# Altium project DevKit.PrjPcb
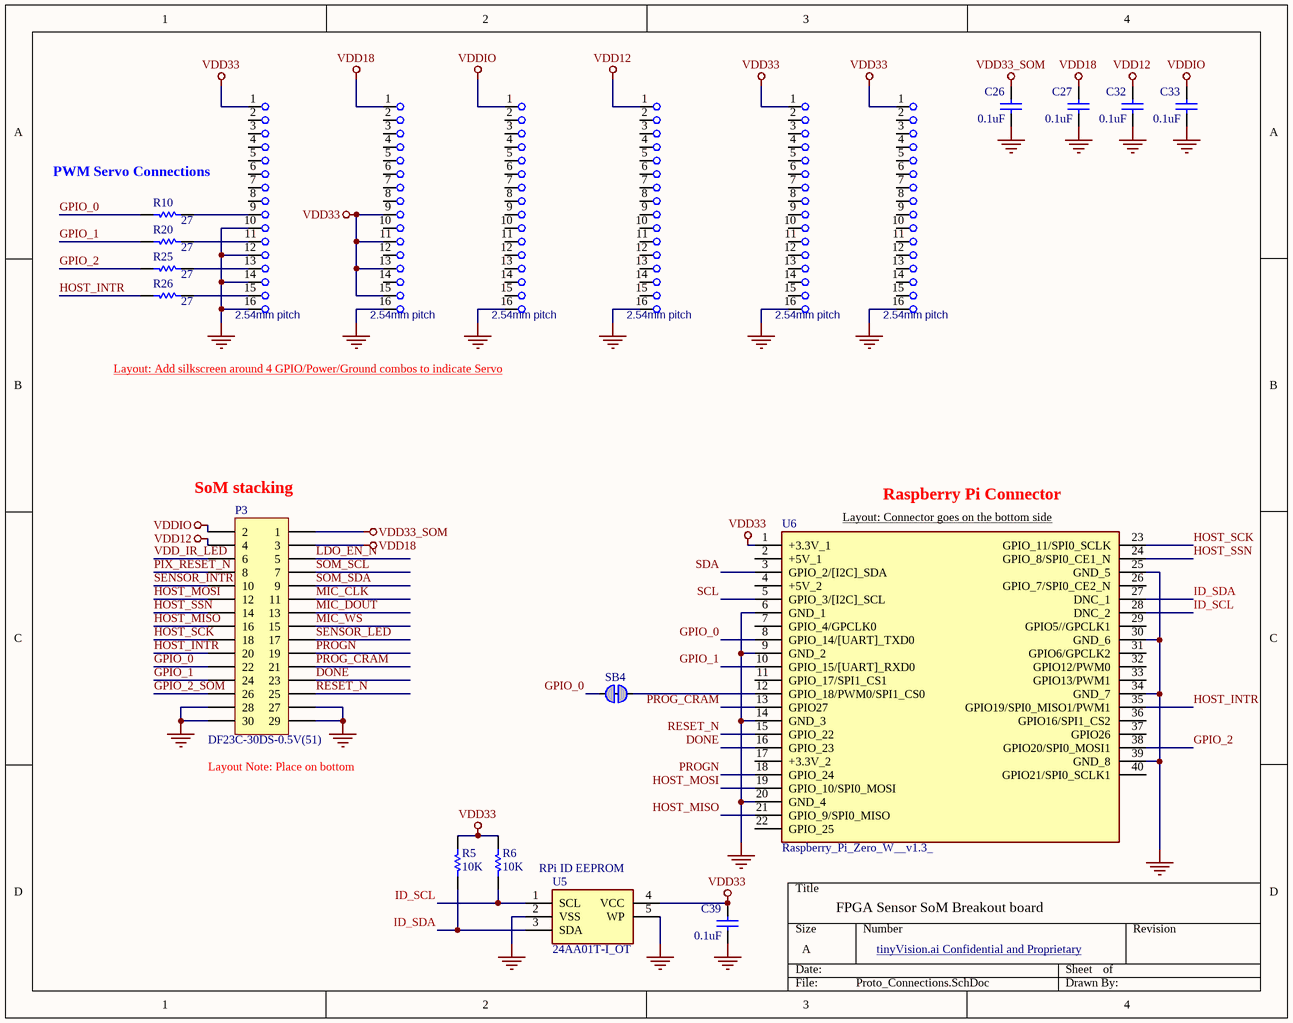
[diagram p0: Proto_Connections.SchDoc]
1 sheet, 21 parts. Net scope: global (net labels, ports and power ports of the same name join across sheets).
Board file: DevKit - PCB.PcbDoc

## Sheet Proto_Connections.SchDoc
size A

### Parts
C26  0.1uF  [CAPC1005X60N]
C27  0.1uF  [CAPC1005X60N]
C32  0.1uF  [CAPC1005X60N]
C33  0.1uF  [CAPC1005X60N]
C39  0.1uF  [CAPC1005X60N]
LEFT2  value 2.54mm pitch  [HDR2x8]  (hidden comment: CONN_GENERIC_16)
LEFT3  value 2.54mm pitch  [HDR2x8]  (hidden comment: CONN_GENERIC_16)
LEFT4  value 2.54mm pitch  [HDR2x8]  (hidden comment: CONN_GENERIC_16)
LEFT5  value 2.54mm pitch  [HDR2x8]  (hidden comment: CONN_GENERIC_16)
LEFT6  value 2.54mm pitch  [HDR2x8]  (hidden comment: CONN_GENERIC_16)
LEFT7  value 2.54mm pitch  [HDR2x8]  (hidden comment: CONN_GENERIC_16)
P3  DF23C-30DS-0.5V(51)  [DF23C-30DS-0.5V]
R5  10K  [RESC1005X40N]
R6  10K  [RESC1005X40N]
R10  27  [RESC1005X40N]
R20  27  [RESC1005X40N]
R25  27  [RESC1005X40N]
R26  27  [RESC1005X40N]
SB4  Solderbridge  [Solderbridge_Shorted]  (value not drawn)  (net tie, no BOM)
U5  24AA01T-I_OT  [SOT23-5]
U6  Raspberry_Pi_Zero_W__v1.3_  [RPI0w1.3]

### Nets
GND: C26.2 C27.2 C32.2 C33.2 C39.1 LEFT2.10 LEFT2.12 LEFT2.14 LEFT2.16 LEFT3.16 LEFT4.16 LEFT5.16 LEFT6.16 LEFT7.16 P3.27 P3.28 P3.29 P3.30 U5.2(VSS) U5.5(WP) U6.6(GND_1) U6.9(GND_2) U6.14(GND_3) U6.20(GND_4) U6.25(GND_5) U6.30(GND_6) U6.34(GND_7) U6.39(GND_8)
VDD12: C32.1 LEFT5.1 P3.4
VDD18: C27.1 LEFT3.1 P3.3
VDD33: C39.2 LEFT2.1 LEFT3.9 LEFT3.11 LEFT3.13 LEFT3.15 LEFT6.1 LEFT7.1 R5.2 R6.2 U5.4(VCC) U6.1(+3.3V_1)
VDD33_SOM: C26.1 P3.1
VDDIO: C33.1 LEFT4.1 P3.2
DONE: P3.23 U6.16(GPIO_23)
GPIO_0: P3.22 R10.2 SB4.2 U6.8(GPIO_14/[UART]_TXD0)
GPIO_1: P3.24 R20.2 U6.10(GPIO_15/[UART]_RXD0)
GPIO_2: R25.2 U6.38(GPIO20/SPI0_MOSI1)
GPIO_2_SOM: P3.26
HOST_INTR: P3.20 R26.2 U6.35(GPIO19/SPI0_MISO1/PWM1)
HOST_MISO: P3.16 U6.21(GPIO_9/SPI0_MISO)
HOST_MOSI: P3.12 U6.19(GPIO_10/SPI0_MOSI)
HOST_SCK: P3.18 U6.23(GPIO_11/SPI0_SCLK)
HOST_SSN: P3.14 U6.24(GPIO_8/SPI0_CE1_N)
ID_SCL: R6.1 U5.1(SCL) U6.28(DNC_2)
ID_SDA: R5.1 U5.3(SDA) U6.27(DNC_1)
LDO_EN_N: P3.5
MIC_CLK: P3.11
MIC_DOUT: P3.13
MIC_WS: P3.15
PIX_RESET_N: P3.8
PROG_CRAM: P3.21 U6.13(GPIO27)
PROGN: P3.19 U6.18(GPIO_24)
RESET_N: P3.25 U6.15(GPIO_22)
SCL: U6.5(GPIO_3/[I2C]_SCL)
SDA: U6.3(GPIO_2/[I2C]_SDA)
SENSOR_INTR: P3.10
SENSOR_LED: P3.17
SOM_SCL: P3.7
SOM_SDA: P3.9
VDD_IR_LED: P3.6
NetLEFT2_9: LEFT2.9 R10.1
NetLEFT2_11: LEFT2.11 R20.1
NetLEFT2_13: LEFT2.13 R25.1
NetLEFT2_15: LEFT2.15 R26.1
NetSB4_1: SB4.1 U6.12(GPIO_18/PWM0/SPI1_CS0)

Not connected (* = marked no-connect by the designer): LEFT2 2 3 4 5 6 7 8; LEFT3 2 3 4 5 6 7 8 10 12 14; LEFT4 2 3 4 5 6 7 8 9 10 11 12 13 14 15; LEFT5 2 3 4 5 6 7 8 9 10 11 12 13 14 15; LEFT6 2 3 4 5 6 7 8 9 10 11 12 13 14 15; LEFT7 2 3 4 5 6 7 8 9 10 11 12 13 14 15; U6 2(+5V_1) 4(+5V_2) 7(GPIO_4/GPCLK0) 11(GPIO_17/SPI1_CS1) 17(+3.3V_2) 22(GPIO_25) 26(GPIO_7/SPI0_CE2_N) 29(GPIO5//GPCLK1) 31(GPIO6/GPCLK2) 32(GPIO12/PWM0) 33(GPIO13/PWM1) 36(GPIO16/SPI1_CS2) 37(GPIO26) 40(GPIO21/SPI0_SCLK1)

### Notes on the sheet
- (near R10) PWM Servo Connections
- Layout: Add silkscreen around 4 GPIO/Power/Ground combos to indicate Servo
- (near P3) SoM stacking
- (near U6) Raspberry Pi Connector
- (near U6) Layout: Connector goes on the bottom side
- (near P3) Layout Note: Place on bottom
- RPi ID EEPROM
- FPGA Sensor SoM Breakout board
- tinyVision.ai Confidential and Proprietary

### Library data of the parts
C26 C27 C32 C33 = Cap_100nF_X7R_10%_0402: CAP CER 0.1UF 6.3V 0402; MPN: C0402C104Z4VAC7867; Mfg: KEMET; Supplier PN: 399-1043-1-ND
C39 = Cap_1uF_X5R_10%_6V3_0402: CAP CER 0.1UF 16V Y5V 0402; Manufacturer Part Number: CL05F104ZO5NNNC; Manufacturer: Samsung Electro-Mechanics; Part #: E-CAP-042; Supplier Part Number 1: 1276-1004-1-ND; Package: 0402; Height: 0.55mm; Supplier 1: Digi-Key; value: 0.1uF
P3 = Header 15X2: Header, 15-Pin, Dual row; Mfg: Hirose Electric Co Ltd; Supplier PN: H11879CT-ND; MPN: DF23C-30DS-0.5V(51); ComponentLink1URL: https://www.hirose.com/product/en/download_file/key_name/DF23/category/Catalog/doc_file_id/49660/?file_category_id=4&item_id=246&is_series=1&src-supplier=Digi-Key; ComponentLink1Description: https://www.hirose.com/product/en/download_file/key_name/DF23/category/Catalog/doc_file_id/49660/?file_category_id=4&item_id=246&is_series=1&src-supplier=Digi-Key; ComponentLink2URL: http://www.farnell.com/datasheets/1910197.pdf?src-supplier=Element14; ComponentLink2Description: http://www.farnell.com/datasheets/1910197.pdf?src-supplier=Element14; ComponentLink3URL: http://www.hirose.co.jp/cataloge_hp/e68801060.pdf?src-supplier=Avnet+Europe; ComponentLink3Description: http://www.hirose.co.jp/cataloge_hp/e68801060.pdf?src-supplier=Avnet+Europe; ComponentLink4URL: http://www.mouser.com/ds/2/185/DF23_catalog-939018.pdf?src-supplier=Mouser; ComponentLink4Description: http://www.mouser.com/ds/2/185/DF23_catalog-939018.pdf?src-supplier=Mouser; ComponentLink5URL: https://www.hirose.com/product/en/download_file/key_name/DF23C-30DS-0.5V%2851%29/category/Specification%20Sheet/doc_file_id/47546/?file_category_id=9&item_id=06880302851&is_series=&src-supplier=Digi-Key; ComponentLink5Description: https://www.hirose.com/product/en/download_file/key_name/DF23C-30DS-0.5V%2851%29/category/Specification%20Sheet/doc_file_id/47546/?file_category_id=9&item_id=06880302851&is_series=&src-supplier=Digi-Key; ComponentLink6URL: http://www.hirose.co.jp/cataloge_hp/e68801060.pdf?src-supplier=Future+Electronics; ComponentLink6Description: http://www.hirose.co.jp/cataloge_hp/e68801060.pdf?src-supplier=Future+Electronics; ComponentLink7URL: http://www.hirose.co.jp/cataloge_hp/e68801060.pdf?src-supplier=Avnet; ComponentLink7Description: http://www.hirose.co.jp/cataloge_hp/e68801060.pdf?src-supplier=Avnet
R5 R6 = Res_10K_1%_0402: RES 10K OHM 5% 1/16W 0402; Manufacturer Part Number: RMCF0402JT10K0; Manufacturer: STACKPOLE; Part #: E-RES-003; Package: 0402; Supplier Part Number 1: RMCF0402JT10K0CT-ND
R10 R20 R25 R26 = Res_10K_1%_0402: RES 27 OHM 5% 1/16W 0402; Manufacturer Part Number: RMCF0402JT10K0; Manufacturer: STACKPOLE; Part #: E-RES-003; Package: 0402; Supplier Part Number 1: RMCF0402JT10K0CT-ND
SB4 = Solderbridge Shorted: Shorted Solderbridge; Artikkelnr Noca: N.A.; Part Number: Solderbridge Shorted; Manufacturer: *; Manufacturer Part Number: *; Datasheet: *; LatestRevisionDate: 2012-08-07; Pin Count: 2; Publisher: Nordic Semiconductor; Published: 2012-08-07; Value: Solderbridge; Note: *; Supplier: *; Supplier part number: *; 2nd source Supplier: *; 2nd source part number: *; Footprint Doc: Solderbridge_Shorted; Artikkelnr Simpro: N.A.
U5 = 24AA01T-I_OT: IC EEPROM 1K I2C 400KHZ SOT23-5; Manufacturer: Microchip Technology; Manufacturer Part Number: 24AA01T-I/OT; Height: 1.45mm; Supplier Part Number 1: 24AA01T-I/OTCT-ND; Package: SOT-23-5; Supplier 1: Digi-Key; ComponentLink1Description: New link; ComponentLink1URL: *
U6 = Raspberry_Pi_Zero_W__v1.3_: CONN HDR 40POS 0.1 TIN SMD; Manufacturer: Sullins Connector Solutions; Manufacturer Product Number: NPTC202KFMS-RC; Digi-Key Part Number: S5690-ND; Arrow Part Number: Raspberry Pi Zero W (v1.3)